# Altium project EDC_Power_Adapter.PrjPcb
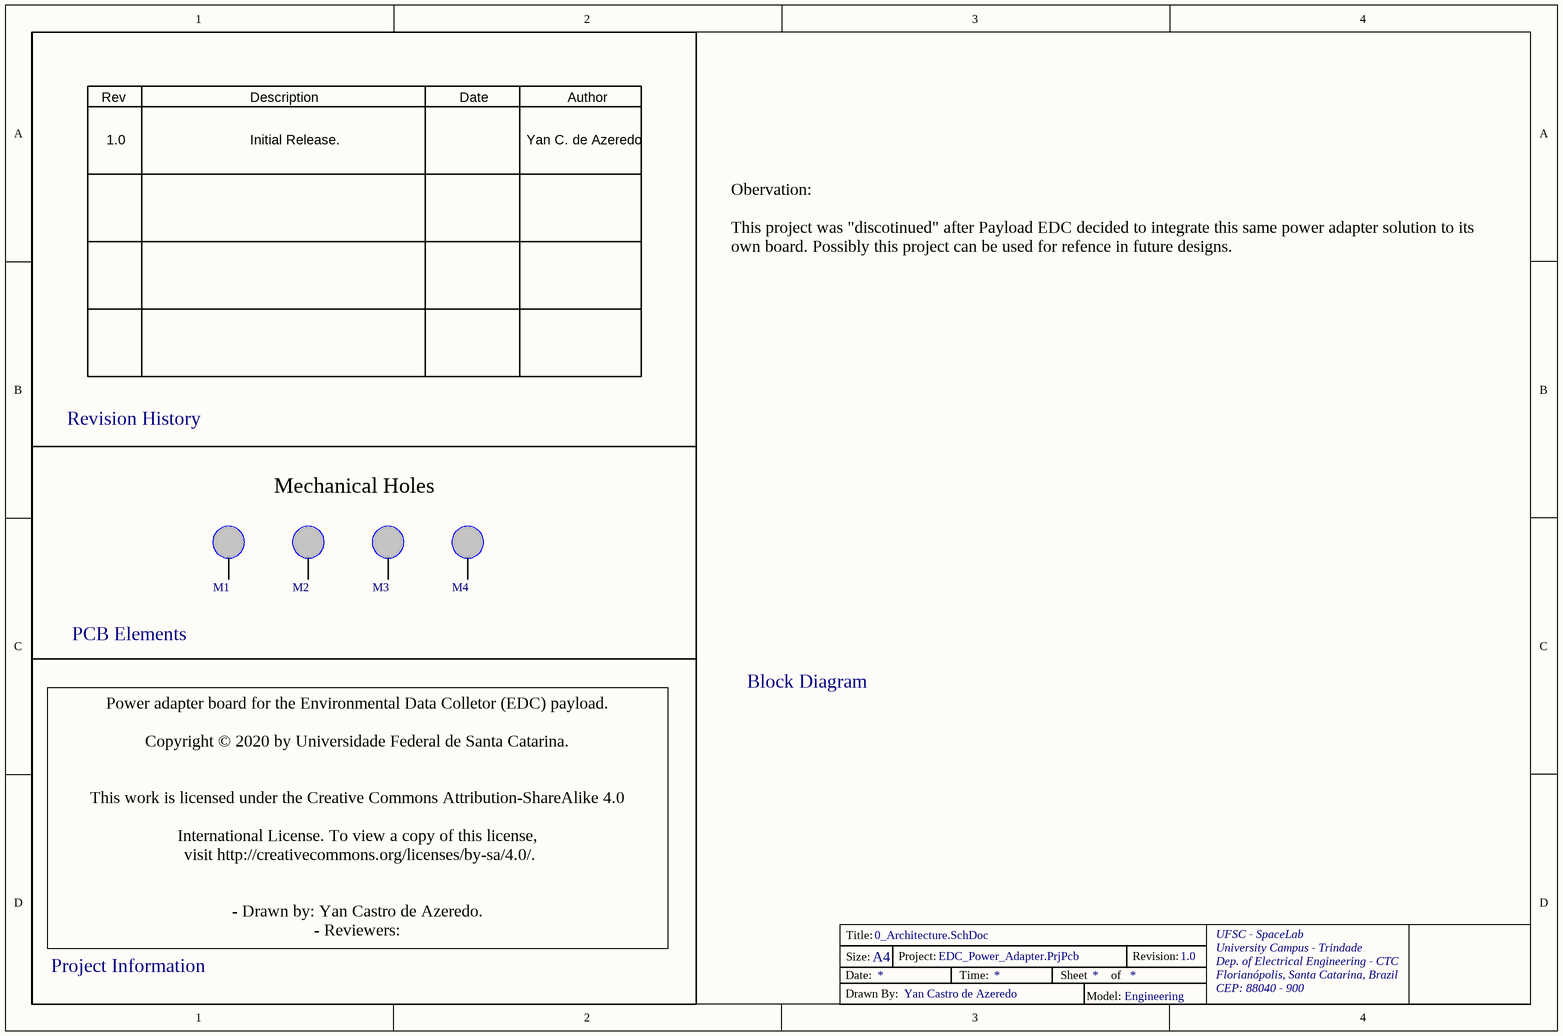
[diagram p0: 0_Architecture.SchDoc]
Drawer: Yan Castro de Azeredo; Model: Engineering; Revision: 1.0
2 sheets, 20 parts. Net scope: global (net labels, ports and power ports of the same name join across sheets).
Board file: EDC_Power_Adapter.PcbDoc
Sheets:
  0_Architecture.SchDoc
  1_Power_Switches.SchDoc

## Sheet 0_Architecture.SchDoc
size A4; Organization: SpaceLab UFSC; Address1: UFSC - SpaceLab; Address2: University Campus - Trindade; Address3: Dep. of Electrical Engineering - CTC; Address4: Florianópolis, Santa Catarina, Brazil; Revision: 1.0; Address5: CEP: 88040 - 900

### Parts
M1  Mechanical hole 3.5mm  [Mechanical hole 3.5mm]  (value not drawn)  (no BOM)
M2  Mechanical hole 3.5mm  [Mechanical hole 3.5mm]  (value not drawn)  (no BOM)
M3  Mechanical hole 3.5mm  [Mechanical hole 3.5mm]  (value not drawn)  (no BOM)
M4  Mechanical hole 3.5mm  [Mechanical hole 3.5mm]  (value not drawn)  (no BOM)

### Nets

Not connected (* = marked no-connect by the designer): M1 0; M2 0; M3 0; M4 0

### Notes on the sheet
- Rev
- Description
- Date
- Author
- 1.0
- Initial Release.
- Yan C. de Azeredo
- Obervation:
  This project was "discotinued" after Payload EDC decided to integrate this same power adapter solution to its own board. Possibly this project can be used for refence in future designs.
- Revision History
- Mechanical Holes
- PCB Elements
- Block Diagram
- Power adapter board for the Environmental Data Colletor (EDC) payload.
  Copyright © 2020 by Universidade Federal de Santa Catarina.
  This work is licensed under the Creative Commons Attribution-ShareAlike 4.0
  International License. To view a copy of this license,
  visit http://creativecommons.org/licenses/by-sa/4.0/.
  - Drawn by: Yan Castro de Azeredo.
  - Reviewers:
  - Support: Gabriel Mariano Marcelino.
  - Mechanical validation:
- Project Information
- Date:
- Title:
- Size:
- A4
- Project:
- Time:
- Sheet
- of
- Revision:
- UFSC - SpaceLab
- University Campus - Trindade
- Dep. of Electrical Engineering - CTC
- Florianópolis, Santa Catarina, Brazil
- CEP: 88040 - 900
- Drawn By:
- Model:

## Sheet 1_Power_Switches.SchDoc
size A4; Organization: SpaceLab UFSC; Address1: UFSC - SpaceLab; Address2: University Campus - Trindade; Address3: Dep. of Electrical Engineering - CTC; Address4: Florianópolis, Santa Catarina, Brazil; Revision: 1.0; Address5: CEP: 88040 - 900
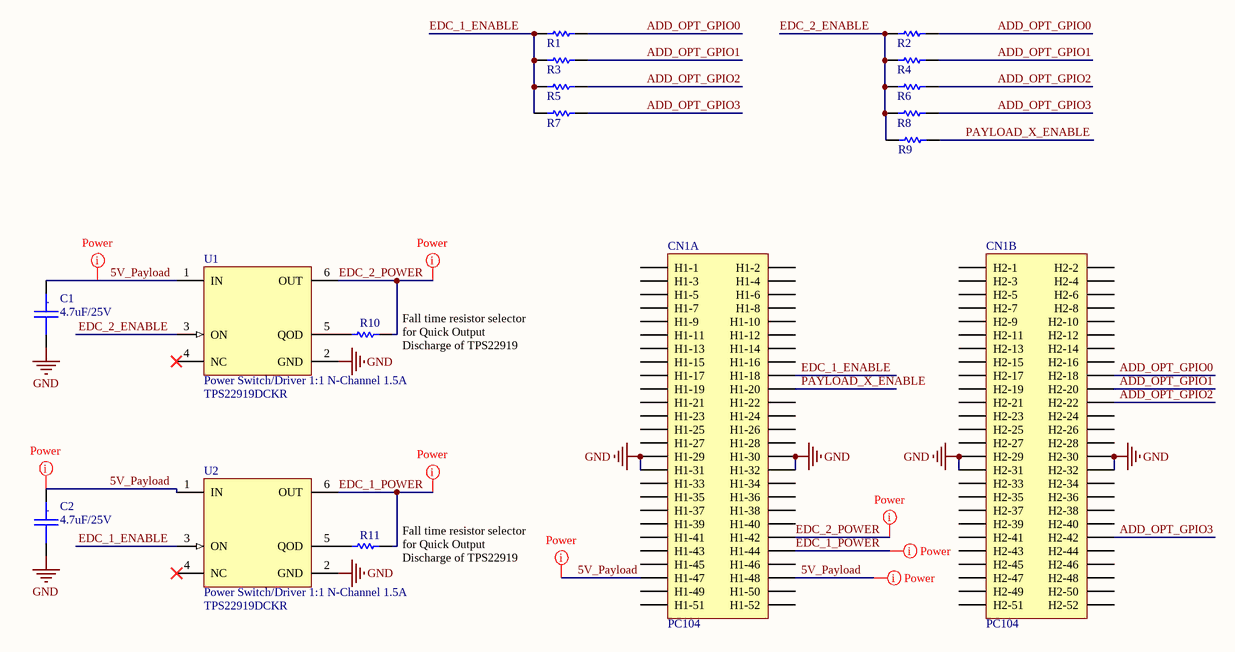
[diagram p1: 1_Power_Switches.SchDoc]

### Parts
C1  4.7uF/25V  [C0805_MD]
C2  4.7uF/25V  [C0805_MD]
CN1  PC104  [PC104_ESQ-126-39-G-D]  (parts A,B of 2)
R1  Optional 0805 resistor  [R0805_MD]  (value not drawn)
R2  Optional 0805 resistor  [R0805_MD]  (value not drawn)
R3  Optional 0805 resistor  [R0805_MD]  (value not drawn)
R4  Optional 0805 resistor  [R0805_MD]  (value not drawn)
R5  Optional 0805 resistor  [R0805_MD]  (value not drawn)
R6  Optional 0805 resistor  [R0805_MD]  (value not drawn)
R7  Optional 0805 resistor  [R0805_MD]  (value not drawn)
R8  Optional 0805 resistor  [R0805_MD]  (value not drawn)
R9  Optional 0805 resistor  [R0805_MD]  (value not drawn)
R10  Optional 0805 resistor  [R0805_MD]  (value not drawn)
R11  Optional 0805 resistor  [R0805_MD]  (value not drawn)
U1  Power Switch/Driver 1:1 N-Channel 1.5A  [6-TSSOP, SC-88, SOT-363]
U2  Power Switch/Driver 1:1 N-Channel 1.5A  [6-TSSOP, SC-88, SOT-363]

### Nets
GND: C1.2 C2.2 CN1.H1-29 CN1.H1-30 CN1.H1-31 CN1.H1-32 CN1.H2-29 CN1.H2-30 CN1.H2-31 U1.2(GND) U2.2(GND)
5V_Payload: C1.1 C2.1 CN1.H1-47 CN1.H1-48 U1.1(IN) U2.1(IN)
ADD_OPT_GPIO0: CN1.H2-18 R1.1 R2.1
ADD_OPT_GPIO1: CN1.H2-20 R3.1 R4.1
ADD_OPT_GPIO2: CN1.H2-22 R5.1 R6.1
ADD_OPT_GPIO3: CN1.H2-42 R7.1 R8.1
EDC_1_ENABLE: CN1.H1-18 R1.2 R3.2 R5.2 R7.2 U2.3(ON)
EDC_1_POWER: CN1.H1-44 R11.1 U2.6(OUT)
EDC_2_ENABLE: R2.2 R4.2 R6.2 R8.2 R9.2 U1.3(ON)
EDC_2_POWER: CN1.H1-42 R10.1 U1.6(OUT)
PAYLOAD_X_ENABLE: CN1.H1-20 R9.1
NetR10_2: R10.2 U1.5(QOD)
NetR11_2: R11.2 U2.5(QOD)

Not connected (* = marked no-connect by the designer): CN1 H1-1 H1-2 H1-3 H1-4 H1-5 H1-6 H1-7 H1-8 H1-9 H1-10 H1-11 H1-12 H1-13 H1-14 H1-15 H1-16 H1-17 H1-19 H1-21 H1-22 H1-23 H1-24 H1-25 H1-26 H1-27 H1-28 H1-33 H1-34 H1-35 H1-36 H1-37 H1-38 H1-39 H1-40 H1-41 H1-43 H1-45 H1-46 H1-49 H1-50 H1-51 H1-52 H2-1 H2-2 H2-3 H2-4 H2-5 H2-6 H2-7 H2-8 H2-9 H2-10 H2-11 H2-12 H2-13 H2-14 H2-15 H2-16 H2-17 H2-19 H2-21 H2-23 H2-24 H2-25 H2-26 H2-27 H2-28 H2-33 H2-34 H2-35 H2-36 H2-37 H2-38 H2-39 H2-40 H2-41 H2-43 H2-44 H2-45 H2-46 H2-47 H2-48 H2-49 H2-50 H2-51 H2-52; U1 4(NC)*; U2 4(NC)*

### Layout directives
mark named Power: 5V_Payload, EDC_1_POWER, EDC_2_POWER

### Notes on the sheet
- (near R10) Fall time resistor selector for Quick Output Discharge of TPS22919
- (near R11) Fall time resistor selector for Quick Output Discharge of TPS22919
- Date:
- Title:
- Size:
- A4
- Project:
- Time:
- Sheet
- of
- Revision:
- UFSC - SpaceLab
- University Campus - Trindade
- Dep. of Electrical Engineering - CTC
- Florianópolis, Santa Catarina, Brazil
- CEP: 88040 - 900
- Drawn By:
- Model:
- (in symbol C2012X7R1E475K125AB) .

### Library data of the parts
C1 C2 = C2012X7R1E475K125AB: TDK C2012X7R1E475K125AB SMD Multilayer Ceramic Capacitor, 0805 [2012 Metric], 4.7uF, 25 V,  10%, X7R, C Series; Voltage Rating: 25V; Supplier 1: Digi-Key; Manufacturer: TDK; Manufacturer Part Number: C2012X7R1E475K125AB; RoHS: Yes; Category: Ceramic Capacitors; Stock 1: 157436; Pricing 1: 1=0,52000, 10=0,36300, 50=0,25420, 100=0,21790, 500=0,16344, 1000=0,13802 (USD); Mount: Surface Mount; Case/Package: 0805; Weight: 0.000194oz; Case Code (Metric): 2012; Case Code (Imperial): 0805; Dielectric Material: Ceramic; Min Operating Temperature: -55°C; Max Operating Temperature: 125°C; Capacitance: 4.7uF; Tolerance: 10%; Dielectric: X7R; Packaging: Tape and Reel; Voltage Rating (DC): 25V; Termination: SMD/SMT; Package Quantity: 2000; Composition: Ceramic; Voltage: 25V; Length: 2mm; Height: 1.25mm; Width: 0.049inch; Depth: 1.25mm; Thickness: 0.057inch; Radiation Hardening: No; Lead Free: Lead Free; REACH SVHC: No SVHC; ComponentLink1URL: https://datasheet.ciiva.com/24216/c2012x7r1e475k125ab-265069-24216552.pdf?src-supplier=Mouser; ComponentLink1Description: https://datasheet.ciiva.com/24216/c2012x7r1e475k125ab-265069-24216552.pdf?src-supplier=Mouser; ComponentLink2URL: https://datasheet.ciiva.com/6287/tdkmlcccaprange-6287482.pdf?src-supplier=Digi-Key; ComponentLink2Description: https://datasheet.ciiva.com/6287/tdkmlcccaprange-6287482.pdf?src-supplier=Digi-Key; ComponentLink3URL: https://datasheet.ciiva.com/23803/1796654-23803034.pdf?src-supplier=Newark; ComponentLink3Description: https://datasheet.ciiva.com/23803/1796654-23803034.pdf?src-supplier=Newark; ComponentLink4URL: https://datasheet.ciiva.com/17487/e412-c-17487246.pdf?src-supplier=Avnet+Europe; ComponentLink4Description: https://datasheet.ciiva.com/17487/e412-c-17487246.pdf?src-supplier=Avnet+Europe; Supplier Part Number 1: 445-5972-1-ND
CN1 = PC104_ESQ-126-39-G-D: Conn Elevated Socket SKT 52 POS 2.54mm Solder ST Thru-Hole Tube; Manufacturer: Samtec; Number of Contacts: 52; Gender: Female; Max Current Rating: 6.9A; Contact Resistance: 10mR; Max Voltage Rating (AC): 550V; Partnumber: ESQ-126-39-G-D; Supplier 1: Digi-Key; Manufacturer Part Number: ESQ-126-39-G-D; RoHS: Yes; Category: Headers and Wire Housings; Stock 1: 554; Pricing 1: 1=11,66000, 10=10,60000, 100=9,01000, 500=7,68500, 1000=7,04900, 5000=6,89000 (USD); Contact Plating: Gold; Contact Material: Bronze; Housing Color: Black; Housing Material: Polyester; Min Operating Temperature: -55°C; Max Operating Temperature: 125°C; Packaging: Rail/Tube; Number of Rows: 2; Termination: Solder; Orientation: Straight; Length: 66.55mm; Pitch: 2.54mm; Depth: 4.95mm; Radiation Hardening: No; ComponentLink1URL: http://components.arrow.com/part/dataview/0323_04347945?src-supplier=Arrow+Europe; ComponentLink1Description: http://components.arrow.com/part/dataview/0323_04347945?src-supplier=Arrow+Europe; ComponentLink2URL: http://www.farnell.com/datasheets/2571080.pdf?src-supplier=Newark; ComponentLink2Description: http://www.farnell.com/datasheets/2571080.pdf?src-supplier=Newark; ComponentLink3URL: http://suddendocs.samtec.com/prints/esq-sdt.pdf?src-supplier=Digi-Key; ComponentLink3Description: http://suddendocs.samtec.com/prints/esq-sdt.pdf?src-supplier=Digi-Key; ComponentLink4URL: http://cloud.samtec.com/catalog_english/ESW_TH.PDF?src-supplier=Avnet; ComponentLink4Description: http://cloud.samtec.com/catalog_english/ESW_TH.PDF?src-supplier=Avnet; Supplier Part Number 1: SAM10462-ND
R1-R11 = CRCW08050000Z0EA: VISHAY - CRCW08050000Z0EA - SMD Chip Resistor, Jumper, 0805 [2012 Metric], 0 ohm, CRCW e3 Series, 150 V, Thick Film, 125 mW; Resistance: 0mR; Power Rating: 125mW; Voltage Rating: 150V; Tolerance: 1%; Temperature Coefficient: 100ppm/°C; Supplier 1: Digi-Key; Manufacturer: Vishay; Manufacturer Part Number: CRCW08050000Z0EA; RoHS: Yes; Category: Chip SMD Resistors; Stock 1: 326656; Pricing 1: 1=0,10000, 10=0,03800, 25=0,02800, 50=0,02120, 100=0,01560, 250=0,01192, 500=0,00954, 1000=0,00702 (USD); Case/Package: 0805; Weight: 0.000194oz; Contact Plating: Tin,Lead; Case Code (Imperial): 0805; Case Code (Metric): 2012; Min Operating Temperature: -55°C; Max Operating Temperature: 155°C; Composition: Thick Film; Termination: SMD/SMT; Packaging: Tape and Reel; Package Quantity: 1; Number of Terminations: 2; Military Standard: Not; Max Power Dissipation: 125mW; Voltage Rating (DC): 150V; Features: Automotive AEC-Q200; Length: 2mm; Height: 0.45mm; Width: 1.25mm; Depth: 1.25mm; Radiation Hardening: No; Lead Free: Lead Free; REACH SVHC: Unknown; ComponentLink1URL: https://datasheet.ciiva.com/11811/0900766b80d98b26-11811304.pdf?src-supplier=RSComponents; ComponentLink1Description: https://datasheet.ciiva.com/11811/0900766b80d98b26-11811304.pdf?src-supplier=RSComponents; ComponentLink2URL: https://datasheet.ciiva.com/16883/dcrcwe3-16883622.pdf?src-supplier=Avnet+Europe; ComponentLink2Description: https://datasheet.ciiva.com/16883/dcrcwe3-16883622.pdf?src-supplier=Avnet+Europe; ComponentLink3URL: https://datasheet.ciiva.com/26314/fld-crcw-e3-data-en-26314630.pdf?src-supplier=Distrelec; ComponentLink3Description: https://datasheet.ciiva.com/26314/fld-crcw-e3-data-en-26314630.pdf?src-supplier=Distrelec; ComponentLink4URL: https://datasheet.ciiva.com/5543/dcrcwe3-109170-5543096.pdf?src-supplier=Mouser; ComponentLink4Description: https://datasheet.ciiva.com/5543/dcrcwe3-109170-5543096.pdf?src-supplier=Mouser; ComponentLink5URL: https://datasheet.ciiva.com/16389/dcrcwe3-16389338.pdf?src-supplier=Future+Electronics; ComponentLink5Description: https://datasheet.ciiva.com/16389/dcrcwe3-16389338.pdf?src-supplier=Future+Electronics; ComponentLink6URL: https://datasheet.ciiva.com/16719/70201119-16719706.pdf?src-supplier=Allied+Electronics; ComponentLink6Description: https://datasheet.ciiva.com/16719/70201119-16719706.pdf?src-supplier=Allied+Electronics; ComponentLink7URL: https://datasheet.ciiva.com/2463/dcrcwe3-2463037.pdf?src-supplier=Digi-Key; ComponentLink7Description: https://datasheet.ciiva.com/2463/dcrcwe3-2463037.pdf?src-supplier=Digi-Key; ComponentLink8URL: https://datasheet.ciiva.com/7841/1697337-7841629.pdf?src-supplier=Element14; ComponentLink8Description: https://datasheet.ciiva.com/7841/1697337-7841629.pdf?src-supplier=Element14; ComponentLink9URL: https://datasheet.ciiva.com/2463/dcrcwe3-2463038.pdf?src-supplier=Digi-Key; ComponentLink9Description: https://datasheet.ciiva.com/2463/dcrcwe3-2463038.pdf?src-supplier=Digi-Key; ComponentLink10URL: https://datasheet.ciiva.com/2463/dcrcwe3-2463039.pdf?src-supplier=Digi-Key; ComponentLink10Description: https://datasheet.ciiva.com/2463/dcrcwe3-2463039.pdf?src-supplier=Digi-Key; ComponentLink11URL: https://datasheet.ciiva.com/7841/1720486-7841839.pdf?src-supplier=Element14; ComponentLink11Description: https://datasheet.ciiva.com/7841/1720486-7841839.pdf?src-supplier=Element14; Supplier Part Number 1: 541-0.0ACT-ND
U1 U2 = TPS22919DCKR: 5.5-V, 1.5-A, 90-mΩ load switch with adj. output discharge 6-SC70 -40 to 105; Manufacturer: Texas Instruments; Supplier 1: Digi-Key; RoHS: No; Stock 1: 7943; Pricing 1: 1=0,48000, 10=0,36000, 25=0,31480, 100=0,17990, 250=0,16864, 500=0,13492, 1000=0,10343 (USD); Supplier Part Number 1: 296-TPS22919DCKRCT-ND; Manufacturer Part Number: TPS22919DCKR